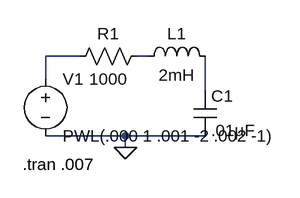
[diagram p0: schematic prob2.asc]
prob2.asc, the LTspice schematic file:
Version 4
SHEET 1 880 680
WIRE 80 80 32 80
WIRE 176 80 160 80
WIRE 32 112 32 80
WIRE 256 128 256 80
WIRE 144 192 32 192
WIRE 256 192 144 192
WIRE 144 208 144 192
FLAG 144 208 0
SYMBOL voltage 32 96 R0
WINDOW 123 0 0 Left 2
WINDOW 39 0 0 Left 2
SYMATTR InstName V1
SYMATTR Value PWL(.000 1 .001 -2 .002 -1)
SYMBOL cap 240 128 R0
SYMATTR InstName C1
SYMATTR Value .01µF
SYMBOL res 176 64 R90
WINDOW 0 0 56 VBottom 2
WINDOW 3 32 56 VTop 2
SYMATTR InstName R1
SYMATTR Value 1000
SYMBOL ind 160 96 R270
WINDOW 0 32 56 VTop 2
WINDOW 3 5 56 VBottom 2
SYMATTR InstName L1
SYMATTR Value 2mH
TEXT 0 232 Left 2 !.tran .007

The netlist it stands for:
* prob2.asc
V1 N001 0 PWL(.000 1 .001 -2 .002 -1)
C1 N003 0 .01µF
R1 N002 N001 1000
L1 N002 N003 2mH
.tran .007
.backanno
.end